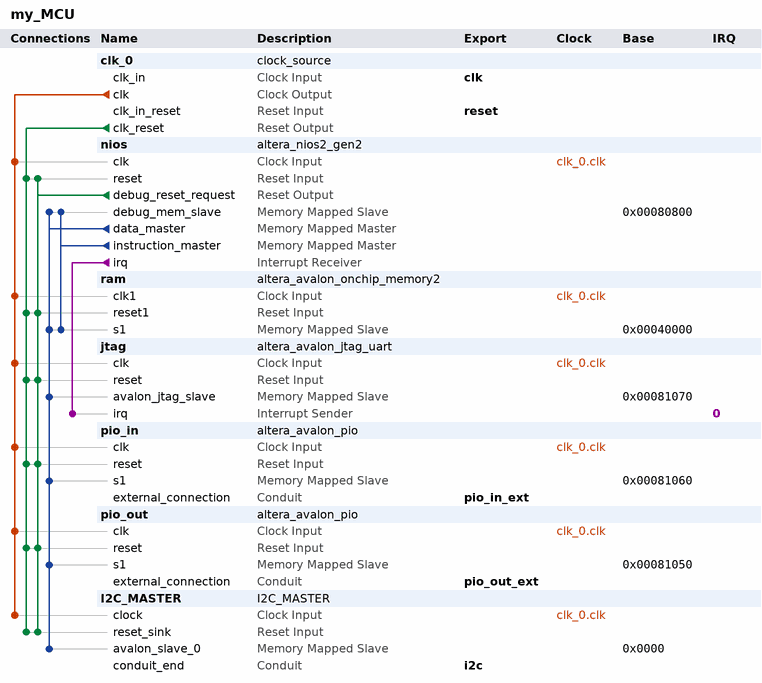
[diagram p0: system contents]
# Platform Designer (Qsys) system my_MCU, Cyclone IV E EP4CE115F29C7
# Parameters at their usual value, and those the tool derives, are not listed.
package require -exact qsys 23.1
create_system my_MCU
set_project_property DEVICE_FAMILY {Cyclone IV E}
set_project_property DEVICE EP4CE115F29C7

add_instance clk_0 clock_source 23.1
set_instance_parameter_value clk_0 clockFrequency 50000000

add_instance nios altera_nios2_gen2 23.1
set_instance_parameter_value nios dcache_size 2048
set_instance_parameter_value nios exceptionSlave ram.s1
set_instance_parameter_value nios icache_size 4096
set_instance_parameter_value nios impl Tiny
set_instance_parameter_value nios resetSlave ram.s1

add_instance ram altera_avalon_onchip_memory2 23.1
set_instance_parameter_value ram dataWidth 32
set_instance_parameter_value ram dualPort false
set_instance_parameter_value ram initMemContent true
set_instance_parameter_value ram initializationFileName onchip_mem.hex
set_instance_parameter_value ram memorySize 262144

add_instance jtag altera_avalon_jtag_uart 23.1
set_instance_parameter_value jtag simInteractiveOptions NO_INTERACTIVE_WINDOWS

add_instance pio_in altera_avalon_pio 23.1
set_instance_parameter_value pio_in direction Input
set_instance_parameter_value pio_in width 16

add_instance pio_out altera_avalon_pio 23.1
set_instance_parameter_value pio_out direction Output
set_instance_parameter_value pio_out width 16

add_instance I2C_MASTER I2C_MASTER 11.0

# connections
add_connection clk_0.clk I2C_MASTER.clock clock
add_connection clk_0.clk jtag.clk clock
add_connection clk_0.clk nios.clk clock
add_connection clk_0.clk pio_in.clk clock
add_connection clk_0.clk pio_out.clk clock
add_connection clk_0.clk ram.clk1 clock
add_connection clk_0.clk_reset I2C_MASTER.reset_sink reset
add_connection clk_0.clk_reset jtag.reset reset
add_connection clk_0.clk_reset nios.reset reset
add_connection clk_0.clk_reset pio_in.reset reset
add_connection clk_0.clk_reset pio_out.reset reset
add_connection clk_0.clk_reset ram.reset1 reset
add_connection nios.debug_reset_request I2C_MASTER.reset_sink reset
add_connection nios.debug_reset_request jtag.reset reset
add_connection nios.debug_reset_request nios.reset reset
add_connection nios.debug_reset_request pio_in.reset reset
add_connection nios.debug_reset_request pio_out.reset reset
add_connection nios.debug_reset_request ram.reset1 reset
add_connection nios.data_master I2C_MASTER.avalon_slave_0 avalon
set_connection_parameter_value nios.data_master/I2C_MASTER.avalon_slave_0 baseAddress 0x0000
add_connection nios.data_master jtag.avalon_jtag_slave avalon
set_connection_parameter_value nios.data_master/jtag.avalon_jtag_slave baseAddress 0x00081070
add_connection nios.data_master nios.debug_mem_slave avalon
set_connection_parameter_value nios.data_master/nios.debug_mem_slave baseAddress 0x00080800
add_connection nios.data_master pio_in.s1 avalon
set_connection_parameter_value nios.data_master/pio_in.s1 baseAddress 0x00081060
add_connection nios.data_master pio_out.s1 avalon
set_connection_parameter_value nios.data_master/pio_out.s1 baseAddress 0x00081050
add_connection nios.data_master ram.s1 avalon
set_connection_parameter_value nios.data_master/ram.s1 baseAddress 0x00040000
add_connection nios.instruction_master nios.debug_mem_slave avalon
set_connection_parameter_value nios.instruction_master/nios.debug_mem_slave baseAddress 0x00080800
add_connection nios.instruction_master ram.s1 avalon
set_connection_parameter_value nios.instruction_master/ram.s1 baseAddress 0x00040000
add_connection nios.irq jtag.irq interrupt
set_connection_parameter_value nios.irq/jtag.irq irqNumber 0

# exported interfaces
add_interface clk clock sink
set_interface_property clk EXPORT_OF clk_0.clk_in
add_interface i2c conduit end
set_interface_property i2c EXPORT_OF I2C_MASTER.conduit_end
add_interface pio_in_ext conduit end
set_interface_property pio_in_ext EXPORT_OF pio_in.external_connection
add_interface pio_out_ext conduit end
set_interface_property pio_out_ext EXPORT_OF pio_out.external_connection
add_interface reset reset sink
set_interface_property reset EXPORT_OF clk_0.clk_in_reset

set_interconnect_requirement {$system} qsys_mm.clockCrossingAdapter HANDSHAKE
set_interconnect_requirement {$system} qsys_mm.enableEccProtection FALSE
set_interconnect_requirement {$system} qsys_mm.insertDefaultSlave FALSE
set_interconnect_requirement {$system} qsys_mm.maxAdditionalLatency 1

save_system my_MCU.qsys
